# Altium schematic sheet Sheet1.SchDoc
size A4
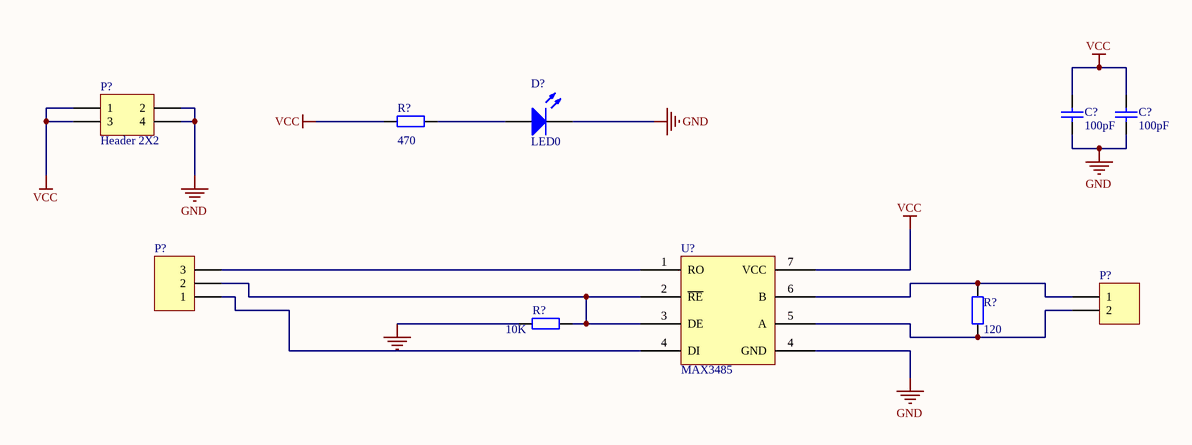
[diagram p0: Sheet1.SchDoc]

## Parts
(Parts that share a designator on the sheet are numbered #1, #2 ... from top to bottom, then left to right.)
C?#1  value 100pF  [C0805]  (hidden comment: Cap)
C?#2  value 100pF  [C0805]  (hidden comment: Cap)
D?  LED0  [C0805]
P?#1  Header 2X2  [HDR2X2]
P?#2  Header 2  [HDR1X2]  (value not drawn)
P?#3  Header 3  [HDR1X3]  (value not drawn)
R?#1  value 470  [C0805]  (hidden comment: Res2)
R?#2  value 10K  [C0805]  (hidden comment: Res2)
R?#3  value 120  [C0805]  (hidden comment: Res2)
U?  MAX3485

## Nets
GND: C?#1.1 C?#2.1 D?.2(K) P?#1.2 P?#1.4 R?#2.1 U?.4(GND)
VCC: C?#1.2 C?#2.2 P?#1.1 P?#1.3 R?#1.1 U?.7(VCC)
NetD?_1: D?.1(A) R?#1.2
NetP?#2_1: P?#2.1 R?#3.2 U?.6(B)
NetP?#2_2: P?#2.2 R?#3.1 U?.5(A)
NetP?#3_1: P?#3.1 U?.4(DI)
NetP?#3_2: P?#3.2 R?#2.2 U?.2(~{RE}) U?.3(DE)
NetP?#3_3: P?#3.3 U?.1(RO)

## Library data of the parts
C?#1 C?#2 = Cap: Capacitor; Published: 8-Jun-2000; LatestRevisionDate: 17-Jul-2002; LatestRevisionNote: Re-released for DXP Platform.; PackageReference: RAD-0.3; Publisher: Altium Limited
D? = LED0: Typical INFRARED GaAs LED; Published: 8-Jun-2000; LatestRevisionDate: 08-Jul-2005; LatestRevisionNote: Mech Layer 1 removed.; PackageReference: LED-0; Publisher: Altium Limited
P?#1 = Header 2X2: Header, 2-Pin, Dual row; LatestRevisionDate: 17-Jul-2002; LatestRevisionNote: Re-released for DXP Platform.; Publisher: Altium Limited
P?#2 = Header 2: Header, 2-Pin; LatestRevisionDate: 17-Jul-2002; LatestRevisionNote: Re-released for DXP Platform.; Publisher: Altium Limited
P?#3 = Header 3: Header, 3-Pin; LatestRevisionDate: 17-Jul-2002; LatestRevisionNote: Re-released for DXP Platform.; Publisher: Altium Limited
R?#1-R?#3 = Res2: Resistor; Published: 8-Jun-2000; LatestRevisionDate: 17-Jul-2002; LatestRevisionNote: Re-released for DXP Platform.; PackageReference: AXIAL-0.4; Publisher: Altium Limited
U? = Component_1